# EAGLE schematic Volting_MUSIC_EAGLE_Prototype_V1_2_Schematic (EAGLE 9.6.2)
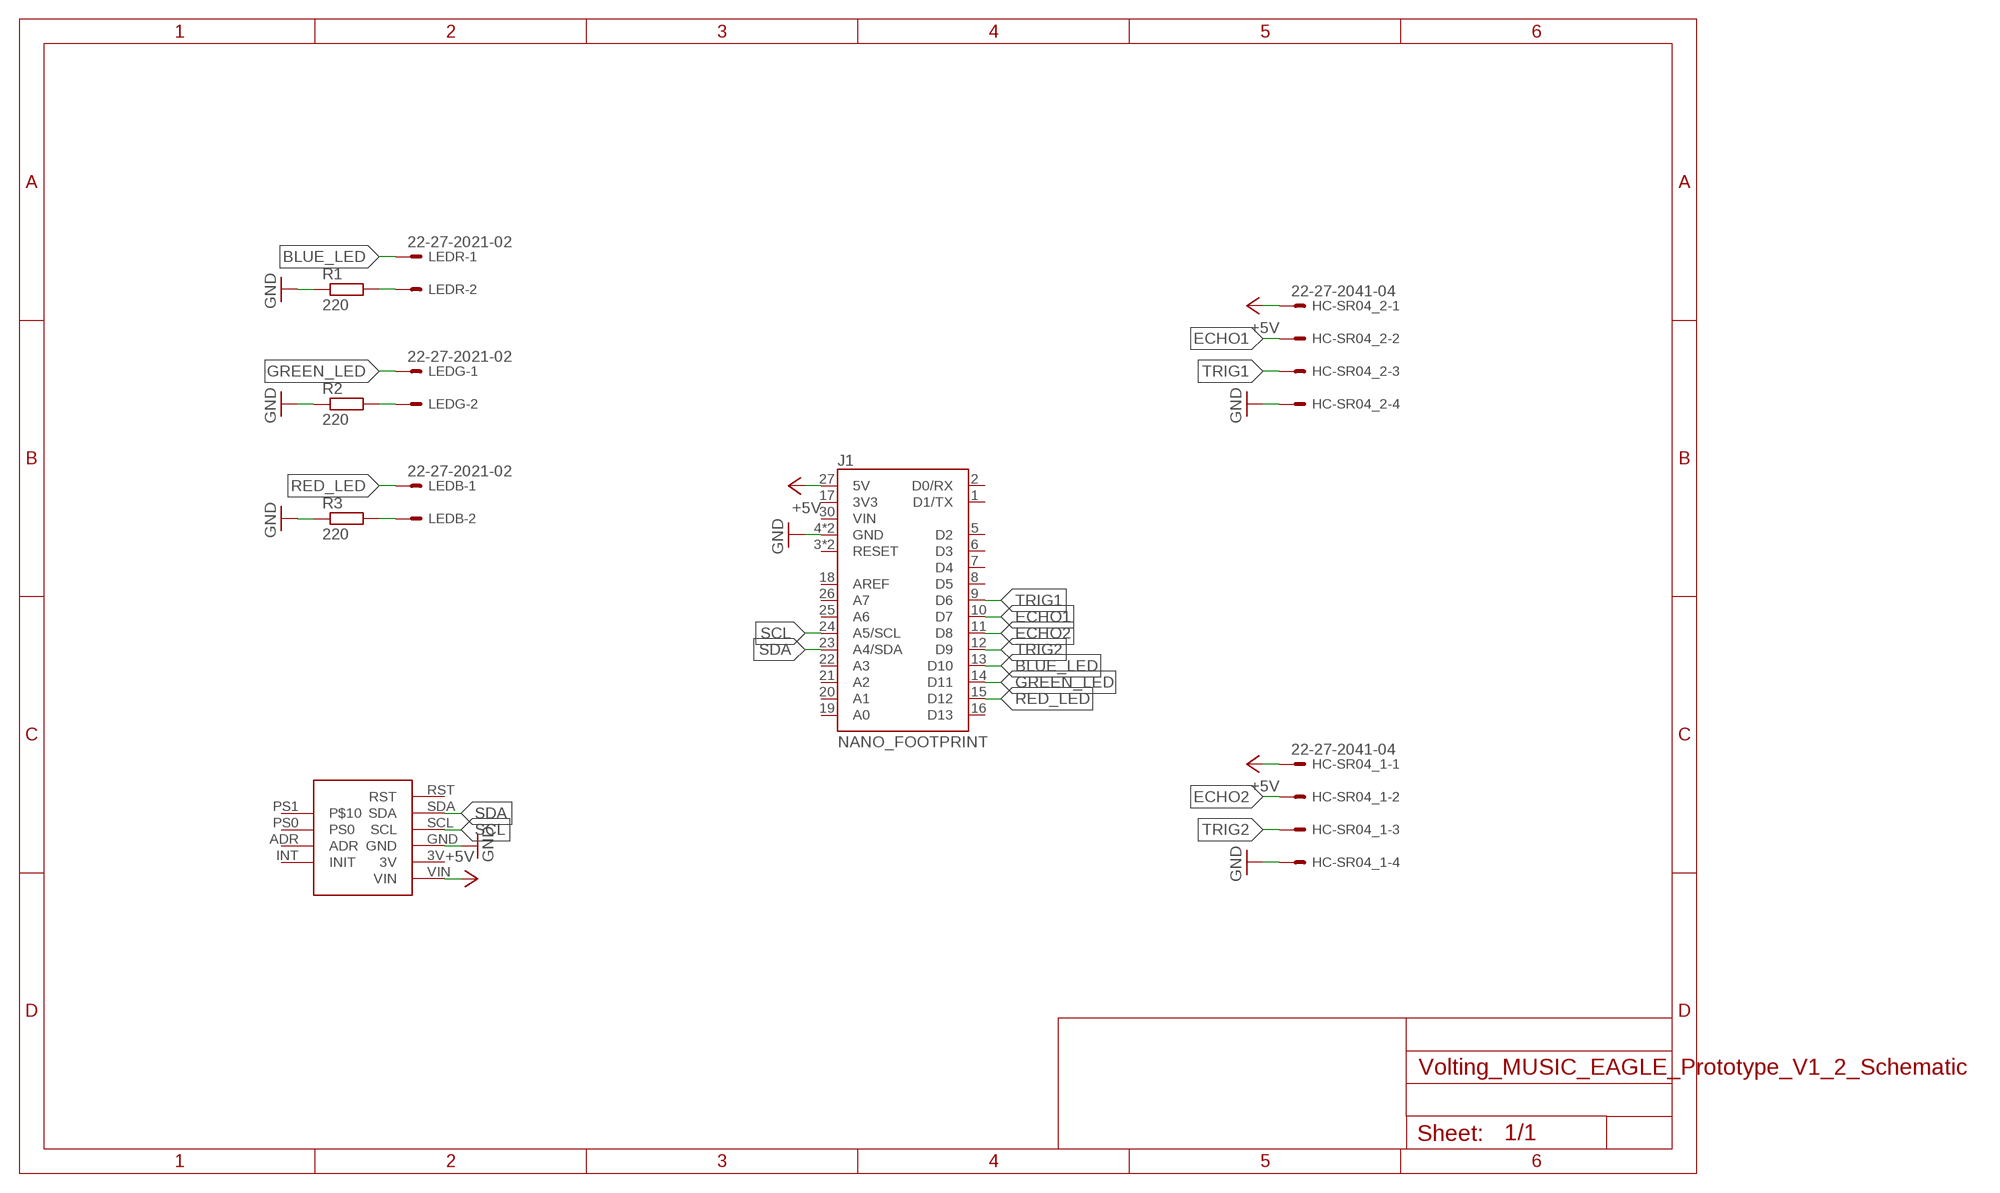
[diagram p0: schematic, sheet 1]

## Parts
HC-SR04_1  22-27-2041-04  [6410-04]
HC-SR04_2  22-27-2041-04  [6410-04]
J1  NANO_FOOTPRINT  [NANO]
LEDB  22-27-2021-02  [6410-02]
LEDG  22-27-2021-02  [6410-02]
LEDR  22-27-2021-02  [6410-02]
R1  220  R-EU_M1206  [M1206]
R2  220  R-EU_M1206  [M1206]
R3  220  R-EU_M1206  [M1206]
U$1  BNO055  [BNO055]

## Nets
+5V: HC-SR04_1.1 HC-SR04_2.1 J1.27(5V) U$1.VIN
BLUE_LED: J1.13(D10) LEDR.1
ECHO1: HC-SR04_2.2 J1.10(D7)
ECHO2: HC-SR04_1.2 J1.11(D8)
GND: HC-SR04_1.4 HC-SR04_2.4 J1.4(GND) J1.29(GND) R1.1 R2.1 R3.1 U$1.GND
GREEN_LED: J1.14(D11) LEDG.1
N$2: LEDR.2 R1.2
N$3: LEDG.2 R2.2
N$4: LEDB.2 R3.2
RED_LED: J1.15(D12) LEDB.1
SCL: J1.24(A5/SCL) U$1.SCL
SDA: J1.23(A4/SDA) U$1.SDA
TRIG1: HC-SR04_2.3 J1.9(D6)
TRIG2: HC-SR04_1.3 J1.12(D9)
Unconnected: J1.1(D1/TX) J1.2(D0/RX) J1.3(RESET) J1.5(D2) J1.6(D3) J1.7(D4) J1.8(D5) J1.16(D13) J1.17(3V3) J1.18(AREF) J1.19(A0) J1.20(A1) J1.21(A2) J1.22(A3) J1.25(A6) J1.26(A7) J1.28(RESET) J1.30(VIN) U$1.3V U$1.ADR U$1.INT(INIT) U$1.PS0 U$1.PS1 U$1.RST

## Library data of the parts
HC-SR04_1 HC-SR04_2 = con-molex:22-?-04: CONNECTOR wire to board 2.54 mm (.1 inch) pitch header; MF: MOLEX; OC_FARNELL: unknown; OC_NEWARK: unknown
J1 = SparkFun-Boards:NANO_FOOTPRINT: Generic Nano Footprint
LEDB LEDG LEDR = con-molex:22-?-02: CONNECTOR wire to board 2.54 mm (.1 inch) pitch header; MF: MOLEX; OC_FARNELL: unknown; OC_NEWARK: unknown
R1-R3 = rcl:R-EU_: RESISTOR, European symbol; SPICEPREFIX: R
U$1 = BNO055_perso:BNO055